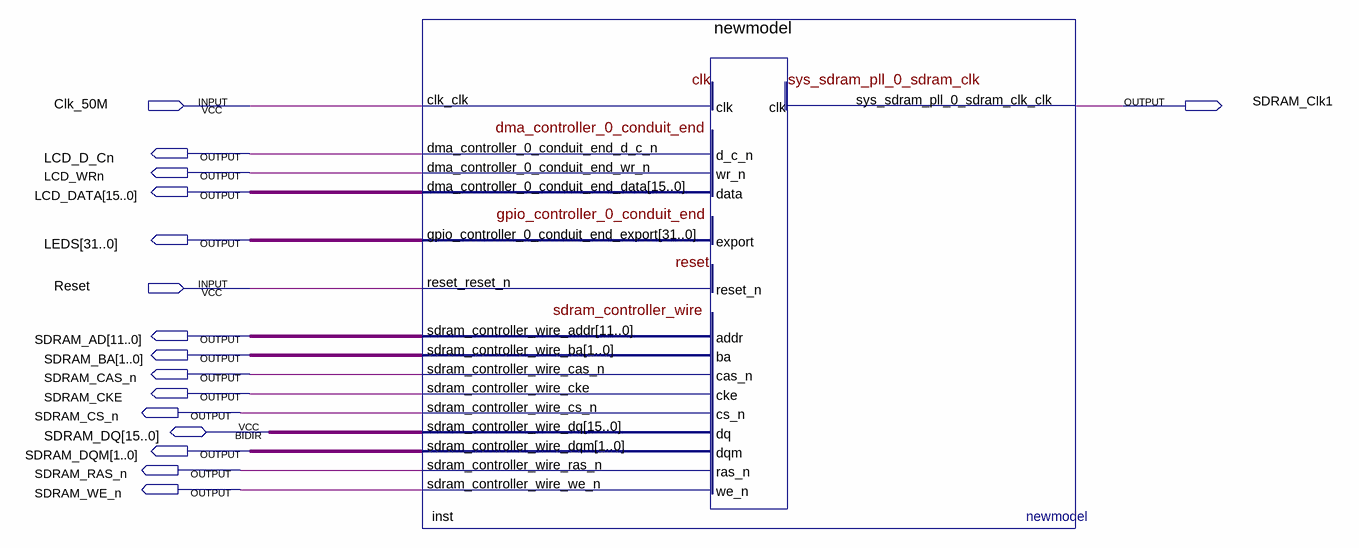
[diagram p0: schematic sheet]
// Quartus schematic labo3.bdf as structural Verilog: 1 symbols, 16 pins
module labo3 (
  input  Clk_50M,
  input  Reset,
  inout  [15:0] SDRAM_DQ,
  output SDRAM_Clk1,
  output LCD_D_Cn,
  output LCD_WRn,
  output [15:0] LCD_DATA,
  output [31:0] LEDS,
  output [11:0] SDRAM_AD,
  output [1:0] SDRAM_BA,
  output SDRAM_CAS_n,
  output SDRAM_CKE,
  output SDRAM_CS_n,
  output [1:0] SDRAM_DQM,
  output SDRAM_RAS_n,
  output SDRAM_WE_n
);

  newmodel inst (
    .clk_clk(Clk_50M), .reset_reset_n(Reset), .dma_controller_0_conduit_end_d_c_n(LCD_D_Cn),
    .dma_controller_0_conduit_end_wr_n(LCD_WRn), .dma_controller_0_conduit_end_data(LCD_DATA),
    .sdram_controller_wire_addr(SDRAM_AD), .sdram_controller_wire_ba(SDRAM_BA),
    .sdram_controller_wire_cas_n(SDRAM_CAS_n), .sdram_controller_wire_cke(SDRAM_CKE),
    .sdram_controller_wire_cs_n(SDRAM_CS_n), .sdram_controller_wire_dqm(SDRAM_DQM),
    .sdram_controller_wire_ras_n(SDRAM_RAS_n), .sdram_controller_wire_we_n(SDRAM_WE_n),
    .sys_sdram_pll_0_sdram_clk_clk(SDRAM_Clk1), .gpio_controller_0_conduit_end_export(LEDS),
    .sdram_controller_wire_dq(SDRAM_DQ));
endmodule
